# EAGLE schematic fox_circuit (EAGLE 6.4)
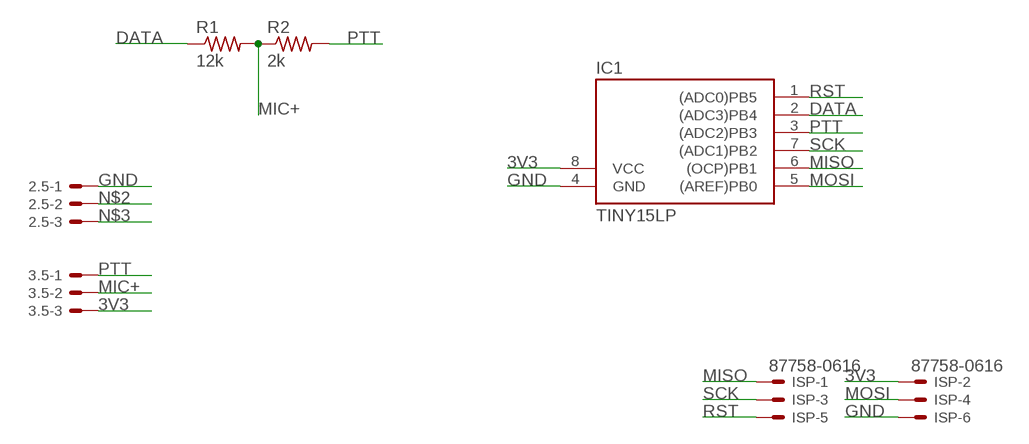
[diagram p0: schematic, sheet 1]

## Parts
2.5  KK-156-3  [KK-156-3]
3.5  KK-156-3  [KK-156-3]
IC1  TINY15LP  [DIL08]
ISP  87758-0616  [87758-0616]
R1  12k  R-US_RDH/15  [RDH/15]
R2  2k  R-US_RDH/15  [RDH/15]

## Nets
3V3: 3.5.3 IC1.8(VCC) ISP.2
DATA: IC1.2((ADC3)PB4) R1.1
GND: 2.5.1 IC1.4(GND) ISP.6
MIC+: 3.5.2 R1.2 R2.1
MISO: IC1.6((OCP)PB1) ISP.1
MOSI: IC1.5((AREF)PB0) ISP.4
N$2: 2.5.2
N$3: 2.5.3
PTT: 3.5.1 IC1.3((ADC2)PB3) R2.2
RST: IC1.1((ADC0)PB5) ISP.5
SCK: IC1.7((ADC1)PB2) ISP.3

## Library data of the parts
2.5 3.5 = con-molex:KK-156-3: KK 156 HEADER Source: http://www.molex.com/pdm_docs/sd/026604100_sd.pdf; OC_FARNELL: unknown; OC_NEWARK: unknown
IC1 = atmel:TINY15L: MICROCONTROLLER 2.7 V 1 Kbytes FLASH 64 bytes EEPROM 4-channel 10 bit ADC; OC_FARNELL: unknown; OC_NEWARK: unknown
ISP = con-molex:87758-0616: 6 Pin - 2mm Dual Row Single Wafer, Vertical T/H HDR Source: http://www.molex.com/pdm_docs/sd/877580616_sd.pdf; MPN: 87758-0616; OC_FARNELL: 7472323; OC_NEWARK: 25M5667
R1 R2 = rcl:R-US_: RESISTOR, American symbol